# EAGLE schematic ACE3NOKB (EAGLE 9.4.2)
Jupiter Ace Schematic from Bodo Wenzels images. Checked against other sources. With edge connectors from https://jupiter-ace.co.uk/hardware_pcb_eagle.html. John Bradley 2019 Updated to use 8k ROM and 2*256Kb * 8 to give 48k ram + 16k in accesable coud page. V Ram changed to 8bit units. The Memeory between 0x3000 and 0x3FFF may be prperly mapped now. Could move base back to 0x3000 from 0x3C00 and rem build ROM.
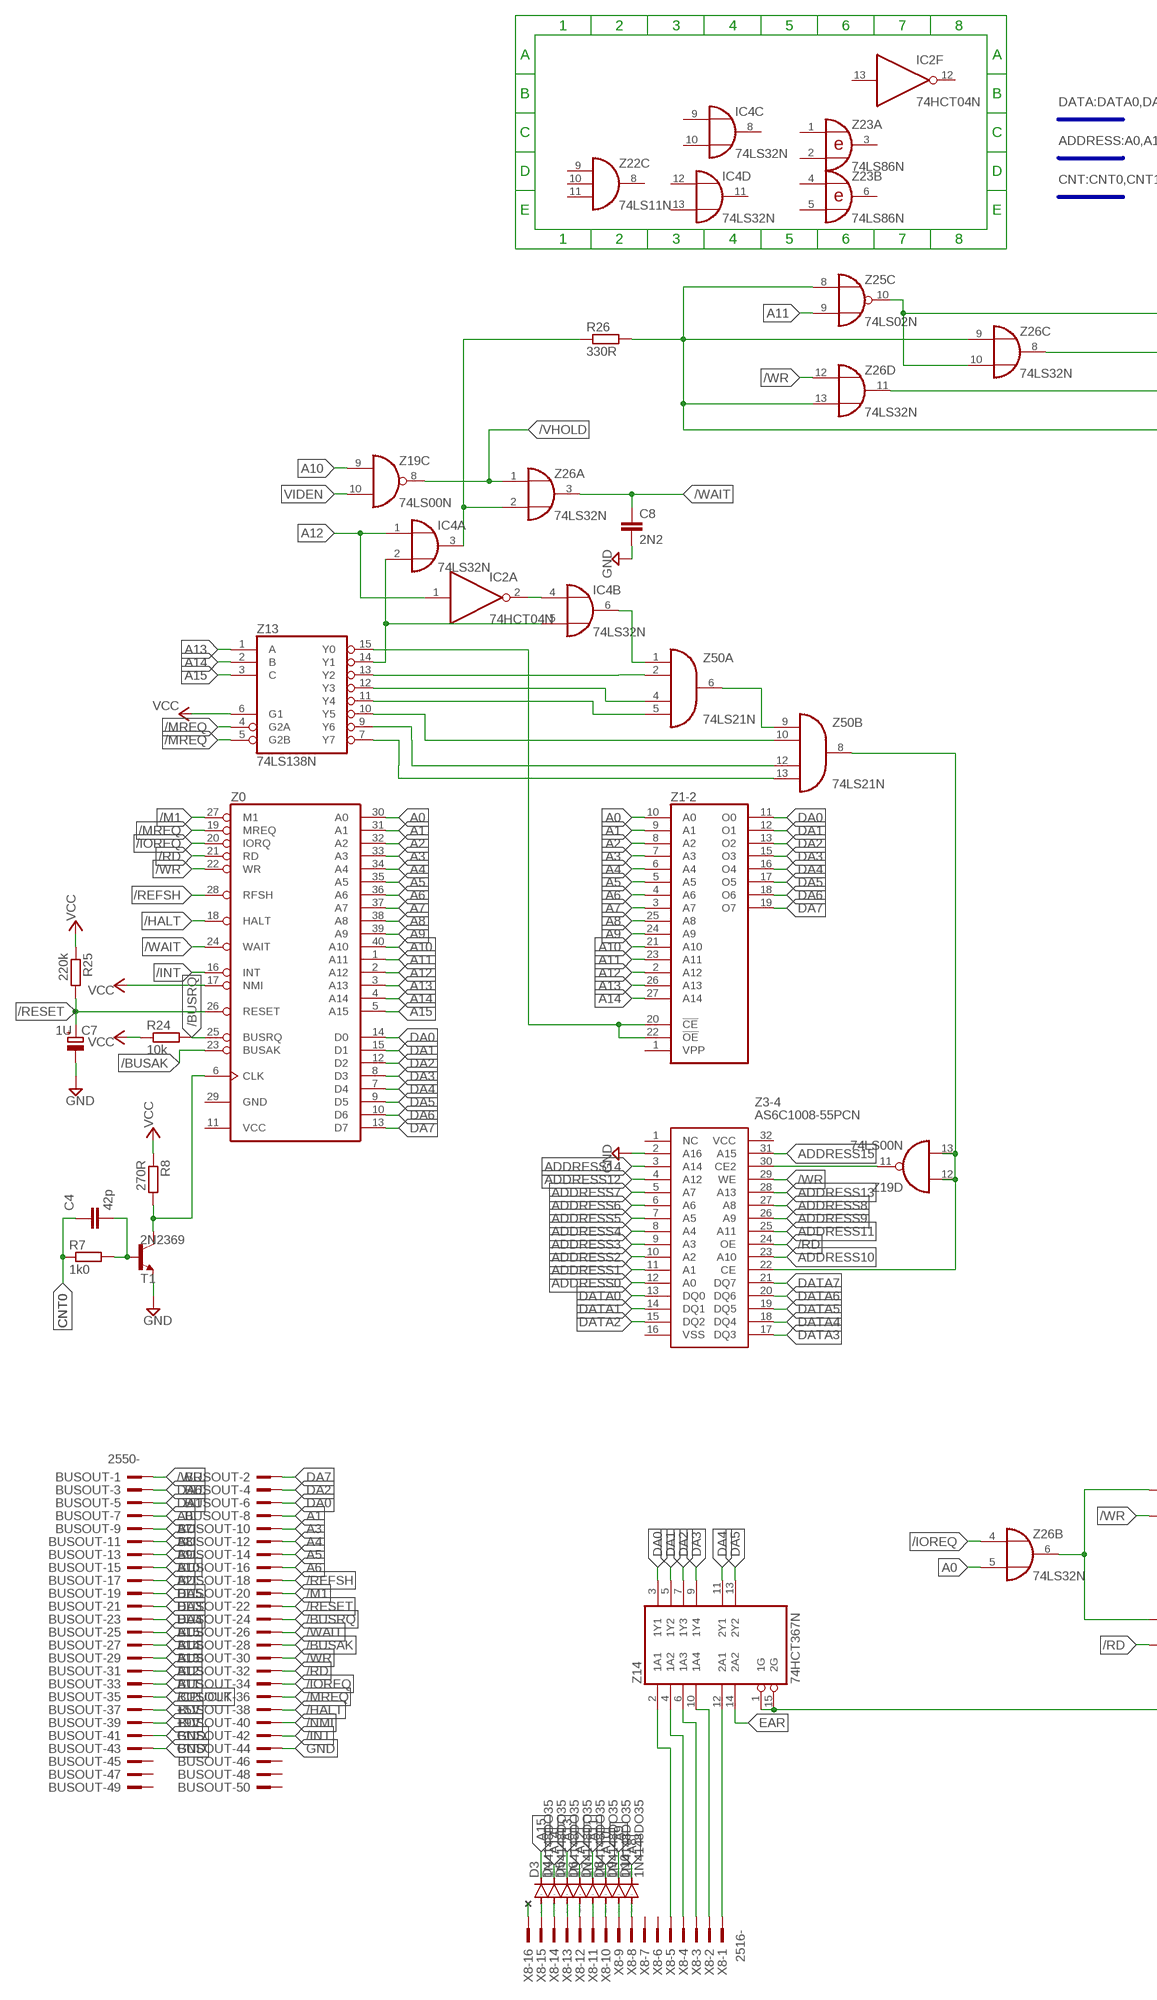
[diagram p0: schematic, sheet 1, part 1 of 2]
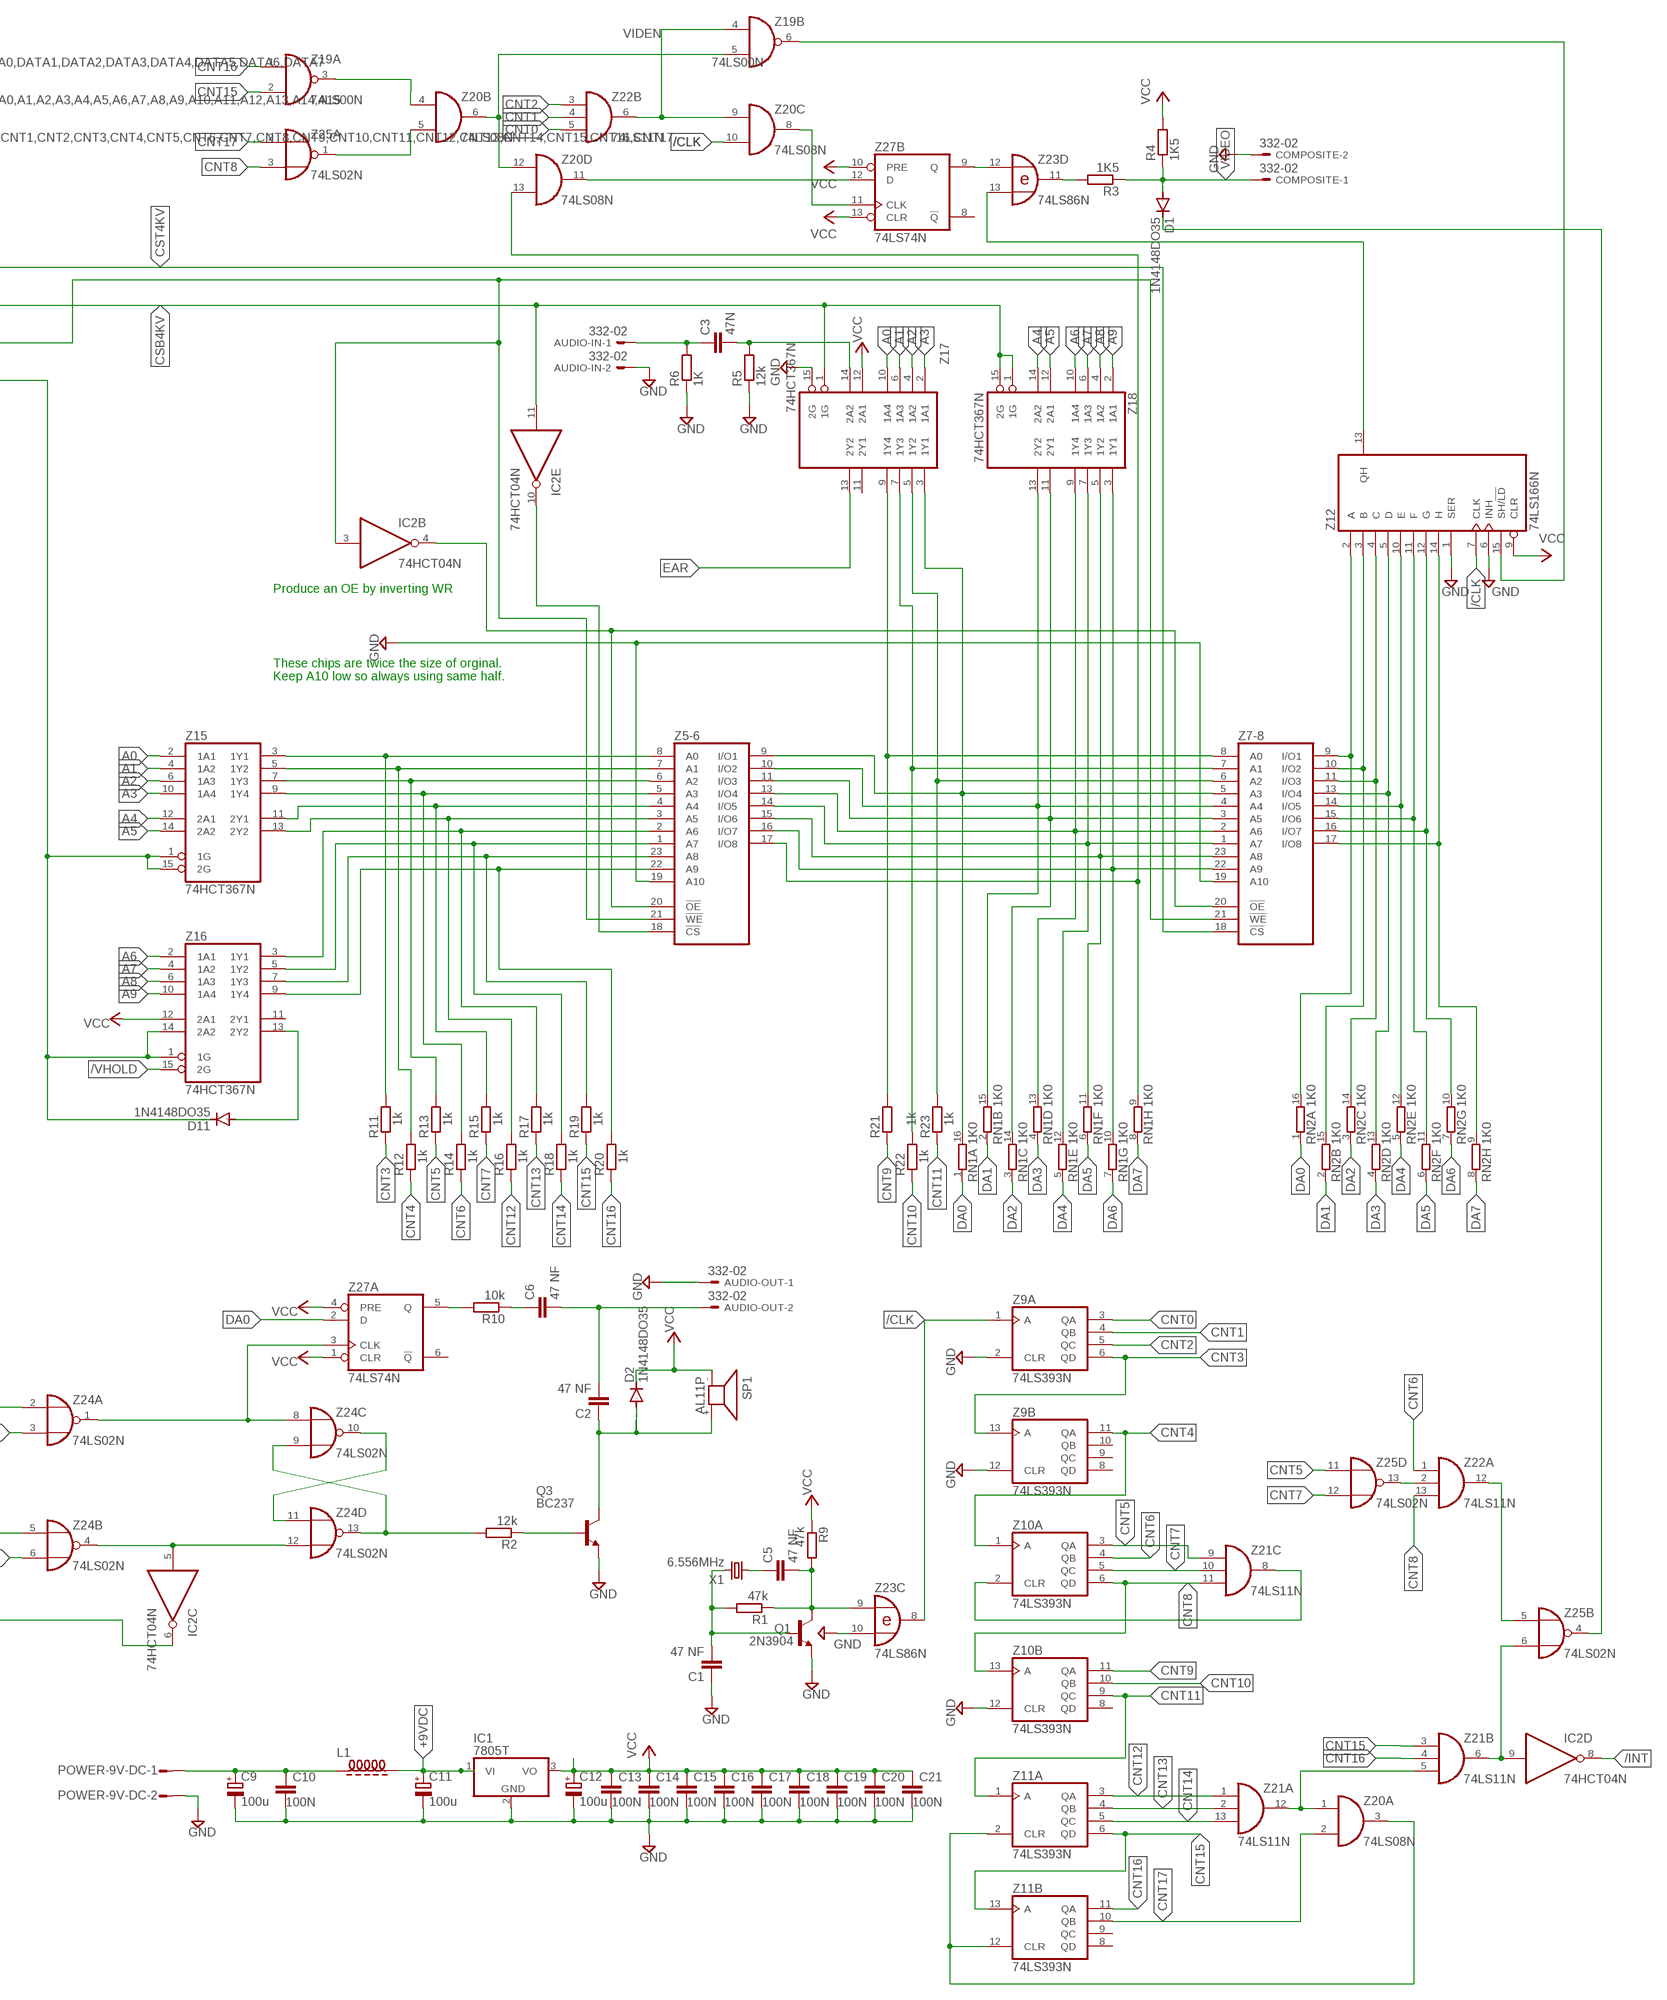
[diagram p1: schematic, sheet 1, part 2 of 2]

## Parts
AUDIO-IN  332-02  [332-02]
AUDIO-OUT  332-02  [332-02]
BUSOUT  2550-  [PAK100/2500-50]
C1  47 NF  C-EU025-024X044  [C025-024X044]
C2  47 NF  C-EU025-024X044  [C025-024X044]
C3  47N  C-EU025-024X044  [C025-024X044]
C4  42p  C-EU025-024X044  [C025-024X044]
C5  47 NF  C-EU025-024X044  [C025-024X044]
C6  47 NF  C-EU025-024X044  [C025-024X044]
C7  1U  CPOL-EUE5-5  [E5-5]
C8  2N2  C-EU025-024X044  [C025-024X044]
C9  100u  CPOL-EUE5-5  [E5-5]
C10  100N  C-EU025-024X044  [C025-024X044]
C11  100u  CPOL-EUE5-5  [E5-5]
C12  100u  CPOL-EUE5-5  [E5-5]
C13  100N  C-EU025-024X044  [C025-024X044]
C14  100N  C-EU025-024X044  [C025-024X044]
C15  100N  C-EU025-024X044  [C025-024X044]
C16  100N  C-EU025-024X044  [C025-024X044]
C17  100N  C-EU025-024X044  [C025-024X044]
C18  100N  C-EU025-024X044  [C025-024X044]
C19  100N  C-EU025-024X044  [C025-024X044]
C20  100N  C-EU025-024X044  [C025-024X044]
C21  100N  C-EU025-024X044  [C025-024X044]
COMPOSITE  332-02  [332-02]
D1  1N4148DO35  DIODE-D-2.5  [D-2.5]
D2  1N4148DO35  DIODE-D-2.5  [D-2.5]
D3  1N4148DO35  DIODE-D-2.5  [D-2.5]
D4  1N4148DO35  DIODE-D-2.5  [D-2.5]
D5  1N4148DO35  DIODE-D-2.5  [D-2.5]
D6  1N4148DO35  DIODE-D-2.5  [D-2.5]
D7  1N4148DO35  DIODE-D-2.5  [D-2.5]
D8  1N4148DO35  DIODE-D-2.5  [D-2.5]
D9  1N4148DO35  DIODE-D-2.5  [D-2.5]
D10  1N4148DO35  DIODE-D-2.5  [D-2.5]
D11  1N4148DO35  DIODE-D-2.5  [D-2.5]
IC1  7805T  [TO220H]
IC2  74HCT04N  [DIL14]
IC4  74LS32N  [DIL14]
L1  Z14/40CCW  [Z15/4]
POWER-9V-DC  L02P  [L02P]
Q1  2N3904  [TO92]
Q3  BC237  [TO92]
R1  47k  R-EU_0207/2V  [0207/2V]
R2  12k  R-EU_0207/2V  [0207/2V]
R3  1K5  R-EU_0207/2V  [0207/2V]
R4  1K5  R-EU_0207/2V  [0207/2V]
R5  12k  R-EU_0207/2V  [0207/2V]
R6  1K  R-EU_0207/2V  [0207/2V]
R7  1k0  R-EU_0204/2V  [0204V]
R8  270R  R-EU_0207/2V  [0207/2V]
R9  47k  R-EU_0207/2V  [0207/2V]
R10  10k  R-EU_0207/2V  [0207/2V]
R11  1k  R-EU_0207/2V  [0207/2V]
R12  1k  R-EU_0207/2V  [0207/2V]
R13  1k  R-EU_0207/2V  [0207/2V]
R14  1k  R-EU_0207/2V  [0207/2V]
R15  1k  R-EU_0207/2V  [0207/2V]
R16  1k  R-EU_0207/2V  [0207/2V]
R17  1k  R-EU_0207/2V  [0207/2V]
R18  1k  R-EU_0207/2V  [0207/2V]
R19  1k  R-EU_0207/2V  [0207/2V]
R20  1k  R-EU_0207/2V  [0207/2V]
R21  1k  R-EU_0207/2V  [0207/2V]
R22  1k  R-EU_0207/2V  [0207/2V]
R23  1k  R-EU_0207/2V  [0207/2V]
R24  10k  R-EU_0207/2V  [0207/2V]
R25  220k  R-EU_0207/2V  [0207/2V]
R26  330R  R-EU_0204/2V  [0204V]
RN1  1K0  8R-N  [DIL16]
RN2  1K0  8R-N  [DIL16]
SP1  AL11P  [AL11P]
T1  2N2369  [TO18]
X1  6.556MHz  CRYSTALHC49U-V  [HC49U-V]
X8  2516-  [PAK100/2500-16]
Z0  Z80CPU  [DIL40]
Z1-2  27256  [DIL28]
Z3-4  AS6C1008-55PCN  [DIP254P1524X393-32]
Z5-6  6116P  [DIL24-6]
Z7-8  6116P  [DIL24-6]
Z9  74LS393N  [DIL14]
Z10  74LS393N  [DIL14]
Z11  74LS393N  [DIL14]
Z12  74LS166N  [DIL16]
Z13  74LS138N  [DIL16]
Z14  74HCT367N  [DIL16]
Z15  74HCT367N  [DIL16]
Z16  74HCT367N  [DIL16]
Z17  74HCT367N  [DIL16]
Z18  74HCT367N  [DIL16]
Z19  74LS00N  [DIL14]
Z20  74LS08N  [DIL14]
Z21  74LS11N  [DIL14]
Z22  74LS11N  [DIL14]
Z23  74LS86N  [DIL14]
Z24  74LS02N  [DIL14]
Z25  74LS02N  [DIL14]
Z26  74LS32N  [DIL14]
Z27  74LS74N  [DIL14]
Z50  74LS21N  [DIL14]

## Nets
2764: Z1-2.20(!CE) Z1-2.22(!OE) Z13.15(Y0)
+5V: BUSOUT.37
+9V: BUSOUT.39
+9VDC: C11.+ IC1.1(VI) L1.2
/BUSAK: BUSOUT.28 Z0.23(BUSAK)
/BUSRQ: BUSOUT.24 R24.2 Z0.25(BUSRQ)
/CLK: Z9.1(A:A) Z12.7(CLK) Z20.10(C:I1) Z23.8(C:O)
/CPUCLK: BUSOUT.35
/HALT: BUSOUT.38 Z0.18(HALT)
/INT: BUSOUT.42 IC2.8(D:O) Z0.16(INT)
/IOREQ: BUSOUT.34 Z0.20(IORQ) Z26.4(B:I0)
/M1: BUSOUT.20 Z0.27(M1)
/MREQ: BUSOUT.36 Z0.19(MREQ) Z13.4(G2A) Z13.5(G2B)
/NMI: BUSOUT.40
/RD: BUSOUT.32 Z0.21(RD) Z3-4.24(OE) Z24.6(B:I1)
/REFSH: BUSOUT.18 Z0.28(RFSH)
/RESET: BUSOUT.22 C7.+ R25.2 Z0.26(RESET)
/VHOLD: Z16.15(2G) Z19.8(C:O) Z26.1(A:I0)
/WAIT: BUSOUT.26 C8.1 Z0.24(WAIT) Z26.3(A:O)
/WR: BUSOUT.1 BUSOUT.30 Z0.22(WR) Z3-4.29(WE) Z24.3(A:I1) Z26.12(D:I0)
A0: BUSOUT.7 Z0.30(A0) Z1-2.10(A0) Z15.2(1A1) Z17.10(1A4) Z26.5(B:I1)
A1: BUSOUT.8 Z0.31(A1) Z1-2.9(A1) Z15.4(1A2) Z17.6(1A3)
A2: BUSOUT.17 Z0.32(A2) Z1-2.8(A2) Z15.6(1A3) Z17.4(1A2)
A3: BUSOUT.10 Z0.33(A3) Z1-2.7(A3) Z15.10(1A4) Z17.2(1A1)
A4: BUSOUT.12 Z0.34(A4) Z1-2.6(A4) Z15.12(2A1) Z18.14(2A2)
A5: BUSOUT.14 Z0.35(A5) Z1-2.5(A5) Z15.14(2A2) Z18.12(2A1)
A6: BUSOUT.16 Z0.36(A6) Z1-2.4(A6) Z16.2(1A1) Z18.10(1A4)
A7: BUSOUT.9 Z0.37(A7) Z1-2.3(A7) Z16.4(1A2) Z18.6(1A3)
A8: BUSOUT.11 D10.C Z0.38(A8) Z1-2.25(A8) Z16.6(1A3) Z18.4(1A2)
A9: BUSOUT.13 D9.C Z0.39(A9) Z1-2.24(A9) Z16.10(1A4) Z18.2(1A1)
A10: BUSOUT.15 D8.C Z0.40(A10) Z1-2.21(A10) Z19.9(C:I0)
A11: BUSOUT.33 D7.C Z0.1(A11) Z1-2.23(A11) Z25.9(C:I1)
A12: BUSOUT.31 D6.C IC2.1(A:I) IC4.1(A:I0) Z0.2(A12) Z1-2.2(A12)
A13: BUSOUT.29 D5.C Z0.3(A13) Z1-2.26(A13) Z13.1(A)
A14: BUSOUT.27 D4.C Z0.4(A14) Z1-2.27(A14) Z13.2(B)
A15: BUSOUT.25 D3.C Z0.5(A15) Z13.3(C)
ADDRESS0: Z3-4.12(A0)
ADDRESS1: Z3-4.11(A1)
ADDRESS2: Z3-4.10(A2)
ADDRESS3: Z3-4.9(A3)
ADDRESS4: Z3-4.8(A4)
ADDRESS5: Z3-4.7(A5)
ADDRESS6: Z3-4.6(A6)
ADDRESS7: Z3-4.5(A7)
ADDRESS8: Z3-4.27(A8)
ADDRESS9: Z3-4.26(A9)
ADDRESS10: Z3-4.23(A10)
ADDRESS11: Z3-4.25(A11)
ADDRESS12: Z3-4.4(A12)
ADDRESS13: Z3-4.28(A13)
ADDRESS14: Z3-4.3(A14)
ADDRESS15: Z3-4.31(A15)
CNT0: C4.1 R7.1 Z9.3(A:QA) Z22.5(B:I2)
CNT1: Z9.4(A:QB) Z22.4(B:I1)
CNT2: Z9.5(A:QC) Z22.3(B:I0)
CNT3: R11.1 Z9.6(A:QD) Z9.13(B:A)
CNT4: R12.1 Z9.11(B:QA) Z10.1(A:A)
CNT5: R13.1 Z10.3(A:QA) Z21.9(C:I0) Z25.11(D:I0)
CNT6: R14.1 Z10.4(A:QB) Z22.1(A:I0)
CNT7: R15.1 Z10.5(A:QC) Z21.10(C:I1) Z25.12(D:I1)
CNT8: Z10.6(A:QD) Z10.13(B:A) Z21.11(C:I2) Z22.13(A:I2) Z25.3(A:I1)
CNT9: R21.1 Z10.11(B:QA)
CNT10: R22.1 Z10.10(B:QB)
CNT11: R23.1 Z10.9(B:QC) Z11.1(A:A)
CNT12: R16.1 Z11.3(A:QA) Z21.1(A:I0)
CNT13: R17.1 Z11.4(A:QB) Z21.2(A:I1)
CNT14: R18.1 Z11.5(A:QC) Z21.13(A:I2)
CNT15: R19.1 Z11.6(A:QD) Z11.13(B:A) Z19.2(A:I1) Z21.3(B:I0)
CNT16: R20.1 Z11.11(B:QA) Z19.1(A:I0) Z21.4(B:I1)
CNT17: Z11.10(B:QB) Z20.2(A:I1) Z25.2(A:I0)
CSB4KV: IC2.11(E:I) Z17.1(1G) Z18.1(1G) Z18.15(2G) Z26.8(C:O)
CST4KV: Z7-8.18(!CS) Z25.10(C:O) Z26.10(C:I1)
DA0: BUSOUT.6 RN1.1 RN2.1 Z0.14(D0) Z1-2.11(O0) Z14.3(1Y1) Z27.2(A:D)
DA1: BUSOUT.5 RN1.2 RN2.2 Z0.15(D1) Z1-2.12(O1) Z14.5(1Y2)
DA2: BUSOUT.4 RN1.3 RN2.3 Z0.12(D2) Z1-2.13(O2) Z14.7(1Y3)
DA3: BUSOUT.21 RN1.4 RN2.4 Z0.8(D3) Z1-2.15(O3) Z14.9(1Y4)
DA4: BUSOUT.23 RN1.5 RN2.5 Z0.7(D4) Z1-2.16(O4) Z14.11(2Y1)
DA5: BUSOUT.19 RN1.6 RN2.6 Z0.9(D5) Z1-2.17(O5) Z14.13(2Y2)
DA6: BUSOUT.3 RN1.7 RN2.7 Z0.10(D6) Z1-2.18(O6)
DA7: BUSOUT.2 RN1.8 RN2.8 Z0.13(D7) Z1-2.19(O7)
DATA0: Z3-4.13(DQ0)
DATA1: Z3-4.14(DQ1)
DATA2: Z3-4.15(DQ2)
DATA3: Z3-4.17(DQ3)
DATA4: Z3-4.18(DQ4)
DATA5: Z3-4.19(DQ5)
DATA6: Z3-4.20(DQ6)
DATA7: Z3-4.21(DQ7)
EAR: Z14.14(2A2) Z17.13(2Y2)
GND: AUDIO-IN.2 AUDIO-OUT.1 BUSOUT.41 BUSOUT.43 BUSOUT.44 C1.1 C7.- C8.2 C9.- C10.1 C11.- C12.- C13.1 C14.1 C15.1 C16.1 C17.1 C18.1 C19.1 C20.1 C21.1 COMPOSITE.2 IC1.2(GND) POWER-9V-DC.2 Q1.3(E) Q3.1(E) R5.1 R6.1 T1.1(E) Z3-4.2(A16) Z5-6.19(A10) Z7-8.19(A10) Z9.2(A:CLR) Z9.12(B:CLR) Z10.12(B:CLR) Z12.1(SER) Z12.6(INH) Z17.15(2G) Z23.10(C:I1)
N$1: Z13.12(Y3) Z50.4(A:I2)
N$2: IC4.3(A:O) R26.1 Z26.2(A:I1)
N$3: Z13.11(Y4) Z50.5(A:I3)
N$4: C3.2 R5.2 Z17.14(2A2)
N$5: R11.2 Z5-6.8(A0) Z15.3(1Y1)
N$6: IC4.2(A:I1) IC4.5(B:I1) Z13.14(Y1)
N$7: IC4.6(B:O) Z50.1(A:I0)
N$8: IC2.3(B:I) Z5-6.21(!WE) Z7-8.21(!WE) Z26.11(D:O)
N$9: IC2.4(B:O) Z5-6.20(!OE) Z7-8.20(!OE)
N$10: Z19.3(A:O) Z20.4(B:I0)
N$11: Z20.5(B:I1) Z25.1(A:O)
N$12: AUDIO-IN.1 C3.1 R6.2
N$13: R12.2 Z5-6.7(A1) Z15.5(1Y2)
N$14: Z20.11(D:O) Z27.12(B:D)
N$15: Z20.8(C:O) Z27.11(B:CLK)
N$16: R13.2 Z5-6.6(A2) Z15.7(1Y3)
N$17: Z23.12(D:I0) Z27.9(B:Q)
N$18: Z12.13(QH) Z23.13(D:I1)
N$19: R3.2 Z23.11(D:O)
N$20: RN1.12 Z5-6.14(I/O5) Z7-8.1(A7) Z18.7(1Y3)
N$21: IC2.10(E:O) Z5-6.18(!CS)
N$22: Z12.15(SH/!LD) Z19.6(B:O)
N$23: Z13.10(Y5) Z50.10(B:I1)
N$24: R8.2 T1.3(C) Z0.6(CLK)
N$25: Z13.9(Y6) Z50.12(B:I2)
N$26: C4.2 R7.2 T1.2(B)
N$27: RN2.10 Z7-8.16(I/O7) Z12.12(G)
N$28: Z13.7(Y7) Z50.13(B:I3)
N$29: IC2.6(C:O) Z14.1(1G) Z14.15(2G)
N$30: IC2.2(A:O) IC4.4(B:I0)
N$31: Z24.2(A:I0) Z24.5(B:I0) Z26.6(B:O)
N$32: R14.2 Z5-6.5(A3) Z15.9(1Y4)
N$33: C5.2 Q1.1(C) R1.1 R9.2 Z23.9(C:I0)
N$34: Z24.10(C:O) Z24.11(D:I0)
N$35: Z24.1(A:O) Z24.8(C:I0) Z27.3(A:CLK)
N$36: C5.1 X1.1
N$37: R15.2 Z5-6.4(A4) Z15.11(2Y1)
N$38: R2.2 Z24.9(C:I1) Z24.13(D:O)
N$39: IC2.5(C:I) Z24.4(B:O) Z24.12(D:I1)
N$40: Q3.2(B) R2.1
N$41: R10.2 Z27.5(A:Q)
N$42: C6.1 R10.1
N$43: AUDIO-OUT.2 C2.2 C6.2
N$44: C2.1 D2.A Q3.3(C) SP1.+
N$45: R16.2 Z5-6.3(A5) Z15.13(2Y2)
N$46: R17.2 Z5-6.2(A6) Z16.3(1Y1)
N$47: C1.2 Q1.2(B) R1.2 X1.2
N$48: R18.2 Z5-6.1(A7) Z16.5(1Y2)
N$49: Z20.1(A:I0) Z21.5(B:I2) Z21.12(A:O)
N$50: IC2.9(D:I) Z21.6(B:O) Z25.6(B:I1)
N$51: D1.C Z25.4(B:O)
N$52: Z22.2(A:I1) Z25.13(D:O)
N$53: X8.16
N$54: Z10.2(A:CLR) Z21.8(C:O)
N$55: Z11.2(A:CLR) Z11.12(B:CLR) Z20.3(A:O)
N$56: X8.1 Z14.12(2A1)
N$57: X8.2 Z14.10(1A4)
N$58: D3.A X8.15
N$59: Z22.12(A:O) Z25.5(B:I0)
N$60: D4.A X8.14
N$61: D5.A X8.13
N$62: D6.A X8.12
N$63: D7.A X8.11
N$64: D8.A X8.10
N$65: C9.+ C10.2 L1.1 POWER-9V-DC.1
N$66: Z13.13(Y2) Z50.2(A:I1)
N$67: R19.2 Z5-6.23(A8) Z16.7(1Y3)
N$68: R20.2 Z5-6.22(A9) Z16.9(1Y4)
N$69: D11.A Z16.13(2Y2)
N$70: RN1.9 Z5-6.17(I/O8) Z20.13(D:I1)
N$71: R21.2 Z7-8.8(A0) Z17.9(1Y4)
N$72: D9.A X8.9
N$73: R22.2 Z7-8.7(A1) Z17.7(1Y3)
N$74: R23.2 Z7-8.6(A2) Z17.5(1Y2)
N$75: RN1.16 Z5-6.9(I/O1) Z7-8.5(A3) Z17.3(1Y1)
N$76: RN1.15 Z5-6.10(I/O2) Z7-8.4(A4) Z18.13(2Y2)
N$77: D10.A X8.8
N$78: Z50.6(A:O) Z50.9(B:I0)
N$81: RN1.14 Z5-6.11(I/O3) Z7-8.3(A5) Z18.11(2Y1)
N$82: RN1.13 Z5-6.13(I/O4) Z7-8.2(A6) Z18.9(1Y4)
N$84: RN1.11 Z5-6.15(I/O6) Z7-8.23(A8) Z18.5(1Y2)
N$85: RN1.10 Z5-6.16(I/O7) Z7-8.22(A9) Z18.3(1Y1)
N$86: D11.C R26.2 Z15.1(1G) Z15.15(2G) Z16.1(1G) Z16.14(2A2) Z25.8(C:I0) Z26.9(C:I0) Z26.13(D:I1)
N$87: Z3-4.22(CE) Z19.12(D:I0) Z19.13(D:I1) Z50.8(B:O)
N$88: Z3-4.30(CE2) Z19.11(D:O)
N$90: RN2.9 Z7-8.17(I/O8) Z12.14(H)
N$91: RN2.16 Z7-8.9(I/O1) Z12.2(A)
N$92: RN2.15 Z7-8.10(I/O2) Z12.3(B)
N$93: RN2.14 Z7-8.11(I/O3) Z12.4(C)
N$94: RN2.13 Z7-8.13(I/O4) Z12.5(D)
N$95: RN2.12 Z7-8.14(I/O5) Z12.10(E)
N$96: RN2.11 Z7-8.15(I/O6) Z12.11(F)
N$121: X8.3 Z14.6(1A3)
N$123: X8.5 Z14.2(1A1)
N$125: X8.4 Z14.4(1A2)
S7BALPHA: Z19.5(B:I1) Z20.6(B:O) Z20.12(D:I0)
VCC: C12.+ C13.2 C14.2 C15.2 C16.2 C17.2 C18.2 C19.2 C20.2 C21.2 D2.C IC1.3(VO) R4.2 R8.1 R9.1 R24.1 R25.1 SP1.- Z0.17(NMI) Z12.9(CLR) Z13.6(G1) Z16.12(2A1) Z17.12(2A1) Z27.1(A:CLR) Z27.4(A:PRE) Z27.10(B:PRE) Z27.13(B:CLR)
VIDEN: Z19.4(B:I0) Z19.10(C:I1) Z20.9(C:I0) Z22.6(B:O)
VIDEO: COMPOSITE.1 D1.A R3.1 R4.1
Unconnected: BUSOUT.45 BUSOUT.46 BUSOUT.47 BUSOUT.48 BUSOUT.49 BUSOUT.50 IC2.12(F:O) IC2.13(F:I) IC4.8(C:O) IC4.9(C:I0) IC4.10(C:I1) IC4.11(D:O) IC4.12(D:I0) IC4.13(D:I1) X8.6 X8.7 Z1-2.1(VPP) Z3-4.1(NC) Z3-4.16(VSS) Z3-4.32(VCC) Z9.8(B:QD) Z9.9(B:QC) Z9.10(B:QB) Z10.8(B:QD) Z11.8(B:QD) Z11.9(B:QC) Z16.11(2Y1) Z17.11(2Y1) Z22.8(C:O) Z22.9(C:I0) Z22.10(C:I1) Z22.11(C:I2) Z23.1(A:I0) Z23.2(A:I1) Z23.3(A:O) Z23.4(B:I0) Z23.5(B:I1) Z23.6(B:O) Z27.6(A:!Q) Z27.8(B:!Q)

## Buses
ADDRESS:A0,A1,A2,A3,A4,A5,A6,A7,A8,A9,A10,A11,A12,A13,A14,A15
DATA:DATA0,DATA1,DATA2,DATA3,DATA4,DATA5,DATA6,DATA7
CNT:CNT0,CNT1,CNT2,CNT3,CNT4,CNT5,CNT6,CNT7,CNT8,CNT9,CNT10,CNT11,CNT12,CNT13,CNT14,CNT15,CNT16,CNT17

## Notes on the sheet
- Produce an OE by inverting WR
- These chips are twice the size of orginal.
  Keep A10 low so always using same half.

## Power pins joined to a net without a drawn wire
GND: IC2.7(P:GND) IC4.7(P:GND) Z0.29(GND) Z1-2.14(GND) Z5-6.12(GND) Z7-8.12(GND) Z9.7(P:GND) Z10.7(P:GND) Z11.7(P:GND) Z12.8(GND) Z13.8(GND) Z14.8(GND) Z15.8(GND) Z16.8(GND) Z17.8(GND) Z18.8(GND) Z19.7(P:GND) Z20.7(P:GND) Z21.7(P:GND) Z22.7(P:GND) Z23.7(P:GND) Z24.7(P:GND) Z25.7(P:GND) Z26.7(P:GND) Z27.7(P:GND) Z50.7(P:GND)
VCC: IC2.14(P:VCC) IC4.14(P:VCC) Z0.11(VCC) Z1-2.28(VCC) Z5-6.24(VCC) Z7-8.24(VCC) Z9.14(P:VCC) Z10.14(P:VCC) Z11.14(P:VCC) Z12.16(VCC) Z13.16(VCC) Z14.16(VCC) Z15.16(VCC) Z16.16(VCC) Z17.16(VCC) Z18.16(VCC) Z19.14(P:VCC) Z20.14(P:VCC) Z21.14(P:VCC) Z22.14(P:VCC) Z23.14(P:VCC) Z24.14(P:VCC) Z25.14(P:VCC) Z26.14(P:VCC) Z27.14(P:VCC) Z50.14(P:VCC)

## Library data of the parts
AUDIO-IN AUDIO-OUT COMPOSITE = con-garry:332-02: 2 Pin - 2mm Dual Row Source: www.mpe-connector.de / garry_shortform_2012.pdf
BUSOUT = con-3m:2550-: 3M (TM) Pak 100 4-Wall Header Source: 3M; OC_FARNELL: unknown; OC_NEWARK: unknown
C1-C6 C8 C10 C13-C21 = rcl:C-EU: CAPACITOR, European symbol; SPICEPREFIX: C
C7 C9 C11 C12 = rcl:CPOL-EU: POLARIZED CAPACITOR, European symbol; SPICEPREFIX: C
D1-D11 = diode:DIODE-: DIODE
IC1 = linear:78*: Positive VOLTAGE REGULATOR Source: http://cache.national.com/ds/LM/LM78L05.pdf http://www.fairchildsemi.com/ds/LM/LM7805.pdf
IC2 = 74xx-eu:74*04: Hex INVERTER
IC4 Z26 = 74xx-eu:74*32: Quad 2-input OR gate
L1 = inductor-neosid:Z?CCW: CHOKE free-suspension choke/nominal inductance winding counter clockwise; OC_FARNELL: unknown; OC_NEWARK: unknown
POWER-9V-DC = con-amp-mt:L02P: AMP MT CONNECTOR; OC_FARNELL: unknown; OC_NEWARK: unknown
Q1 = transistor:2N3904: NPN TRANSISTOR
Q3 = transistor:BC237: NPN TRANSISTOR
R1-R26 = rcl:R-EU_: RESISTOR, European symbol; SPICEPREFIX: R
RN1 RN2 = resistor-dil:8R-N: DIL RESISTOR; OC_FARNELL: unknown; OC_NEWARK: unknown
SP1 = buzzer:AL11P: SPEAKER Source: Buerklin; OC_FARNELL: unknown; OC_NEWARK: unknown
T1 = transistor:2N2369: NPN TRANSISTOR
X1 = crystal:CRYSTAL: CRYSTAL; OC_FARNELL: 1666969; OC_NEWARK: unknown
X8 = con-3m:2516-: 3M (TM) Pak 100 4-Wall Header Source: 3M; OC_FARNELL: unknown; OC_NEWARK: unknown
Z0 = zilog:Z80CPU: Z80 FAMILY DEVICE
Z1-2 = memory:27256: MEMORY
Z3-4 = AS6C1008-55PCN:AS6C1008-55PCN: CMOS SRAM Source: Datasheet <http://uk.rs-online.com/web/p/products/1700891>; DESCRIPTION: CMOS SRAM; HEIGHT: mm; MANUFACTURER_NAME: Alliance Memory; MANUFACTURER_PART_NUMBER: AS6C1008-55PCN; RS_PART_NUMBER: 1700891; RS_PRICE-STOCK: http://uk.rs-online.com/web/p/products/1700891
Z5-6 Z7-8 = memory-idt:6116P: MEMORY; OC_FARNELL: unknown; OC_NEWARK: unknown
Z9-Z11 = 74xx-eu:74*393: Dual 4-bit decade and binary COUNTER
Z12 = 74xx-eu:74*166: 8-bit parallel load SHIFT REGISTER
Z13 = 74xx-eu:74*138: 3-line to 8-line DECODER/DEMULTIPLEXER
Z14-Z18 = 74xx-eu:74*367: Hex BUS DRIVER, 3-state
Z19 = 74xx-eu:74*00: Quad 2-input NAND gate
Z20 = 74xx-eu:74*08: Quad 2-input AND gate
Z21 Z22 = 74xx-eu:74*11: Triple 3-input AND gate
Z23 = 74xx-eu:74*86: Quad 2-input EXCLUSIVE-OR (XOR) gate
Z24 Z25 = 74xx-eu:74*02: Quad 2-input NOR gate
Z27 = 74xx-eu:74*74: Dual D type positive edge triggered FLIP FLOP, preset and clear
Z50 = 74xx-eu:74*21: Dual 4-input AND gate